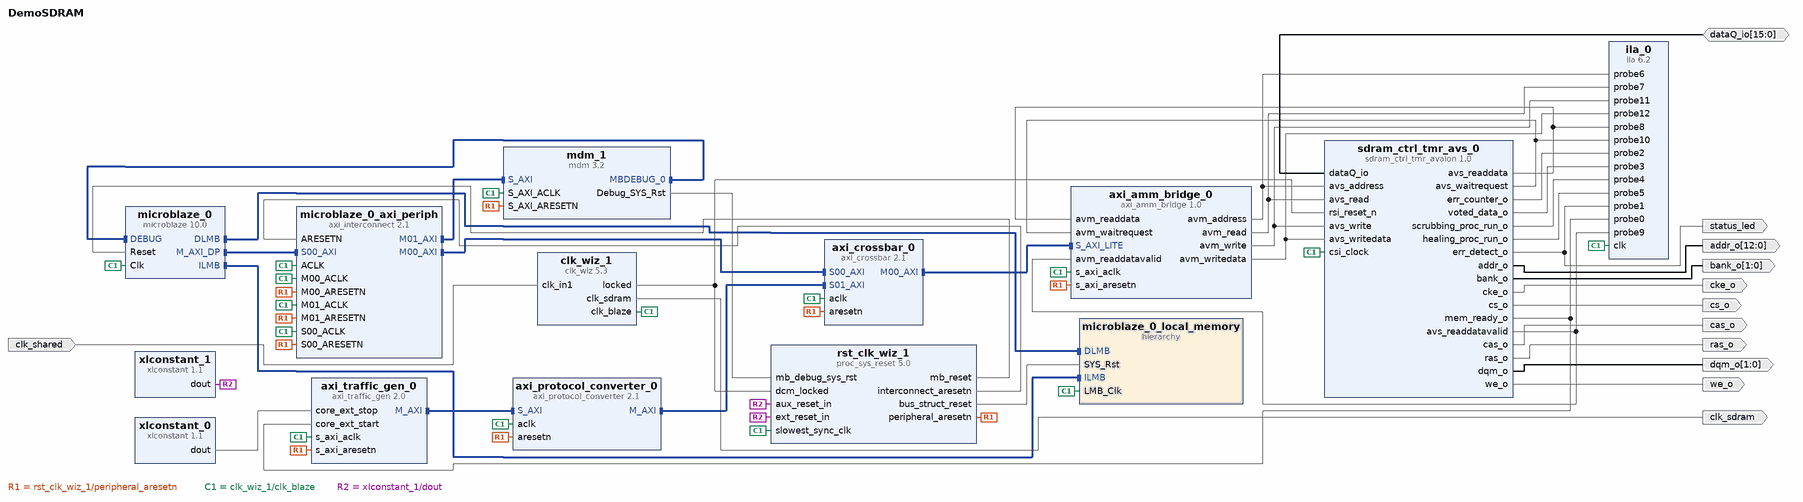
[diagram p0: block diagram of the top level]
# Vivado block design DemoSDRAM, xc7a200tfbg676-1, Vivado 2016.4
create_bd_design DemoSDRAM

create_bd_port -dir I -type clk clk_shared
set_property -dict {CONFIG.FREQ_HZ 12000000} [get_bd_ports clk_shared]
create_bd_port -dir O cke_o
create_bd_port -dir O -from 1 -to 0 bank_o
create_bd_port -dir O -from 12 -to 0 addr_o
create_bd_port -dir O cs_o
create_bd_port -dir O ras_o
create_bd_port -dir O cas_o
create_bd_port -dir O we_o
create_bd_port -dir O -from 1 -to 0 dqm_o
create_bd_port -dir IO -from 15 -to 0 dataQ_io
create_bd_port -dir O status_led
create_bd_port -dir O -type clk clk_sdram

create_bd_cell -type hier microblaze_0_local_memory
create_bd_cell -type ip -vlnv xilinx.com:ip:axi_amm_bridge:1.0 axi_amm_bridge_0
set_property -dict [list \
  CONFIG.C_HAS_READ_DATA_VALID 1 \
  CONFIG.C_READ_LATENCY 2 \
  CONFIG.C_BURST_SUPPORT 0 \
  CONFIG.C_S_AXI_ADDR_WIDTH 24 \
  CONFIG.C_NUM_ADDRESS_RANGES 0 \
  CONFIG.C_HIGH1_ADDR 0x000000000FFFFFFF \
  CONFIG.C_ADDRESS_MODE 0 \
  CONFIG.C_USE_BYTEENABLE 0 \
  CONFIG.C_HAS_RESPONSE 0 \
] [get_bd_cells axi_amm_bridge_0]
create_bd_cell -type ip -vlnv xilinx.com:ip:clk_wiz:5.3 clk_wiz_1
set_property -dict [list \
  CONFIG.PRIMITIVE MMCM \
  CONFIG.USE_MIN_POWER false \
  CONFIG.JITTER_SEL No_Jitter \
  CONFIG.PRIM_IN_FREQ 12 \
  CONFIG.CLKIN1_JITTER_PS 833.33 \
  CONFIG.CLKOUT2_USED true \
  CONFIG.CLKOUT3_USED false \
  CONFIG.NUM_OUT_CLKS 2 \
  CONFIG.CLK_OUT1_PORT clk_blaze \
  CONFIG.CLK_OUT2_PORT clk_sdram \
  CONFIG.CLK_OUT3_PORT clk_sdram \
  CONFIG.CLKOUT1_REQUESTED_OUT_FREQ 48 \
  CONFIG.CLKOUT2_REQUESTED_OUT_FREQ 48 \
  CONFIG.CLKOUT2_REQUESTED_PHASE -18 \
  CONFIG.CLKOUT3_REQUESTED_OUT_FREQ 12 \
  CONFIG.CLKOUT3_REQUESTED_PHASE 0 \
  CONFIG.PRIM_SOURCE Single_ended_clock_capable_pin \
  CONFIG.CLKOUT1_DRIVES BUFGCE \
  CONFIG.CLKOUT2_DRIVES BUFGCE \
  CONFIG.CLKOUT3_DRIVES BUFGCE \
  CONFIG.CLKOUT4_DRIVES BUFGCE \
  CONFIG.CLKOUT5_DRIVES BUFGCE \
  CONFIG.CLKOUT6_DRIVES BUFGCE \
  CONFIG.CLKOUT7_DRIVES BUFGCE \
  CONFIG.FEEDBACK_SOURCE FDBK_AUTO \
  CONFIG.USE_RESET false \
  CONFIG.MMCM_DIVCLK_DIVIDE 1 \
  CONFIG.MMCM_BANDWIDTH OPTIMIZED \
  CONFIG.MMCM_CLKFBOUT_MULT_F 60.000 \
  CONFIG.MMCM_CLKIN1_PERIOD 83.333 \
  CONFIG.MMCM_COMPENSATION ZHOLD \
  CONFIG.MMCM_CLKOUT0_DIVIDE_F 15.000 \
  CONFIG.MMCM_CLKOUT0_DUTY_CYCLE 0.500 \
  CONFIG.MMCM_CLKOUT1_DIVIDE 15 \
  CONFIG.MMCM_CLKOUT1_DUTY_CYCLE 0.500 \
  CONFIG.MMCM_CLKOUT1_PHASE -18.000 \
  CONFIG.MMCM_CLKOUT2_DIVIDE 1 \
  CONFIG.MMCM_CLKOUT2_DUTY_CYCLE 0.500 \
  CONFIG.MMCM_CLKOUT2_PHASE 0.000 \
  CONFIG.USE_SAFE_CLOCK_STARTUP true \
  CONFIG.CLKOUT1_JITTER 547.406 \
  CONFIG.CLKOUT1_PHASE_ERROR 663.293 \
  CONFIG.CLKOUT2_JITTER 547.406 \
  CONFIG.CLKOUT2_PHASE_ERROR 663.293 \
  CONFIG.CLKOUT3_JITTER 673.233 \
  CONFIG.CLKOUT3_PHASE_ERROR 693.818 \
] [get_bd_cells clk_wiz_1]
create_bd_cell -type ip -vlnv xilinx.com:ip:mdm:3.2 mdm_1
set_property -dict {CONFIG.C_USE_UART 1} [get_bd_cells mdm_1]
create_bd_cell -type ip -vlnv xilinx.com:ip:microblaze:10.0 microblaze_0
set_property -dict [list \
  CONFIG.C_D_AXI 1 \
  CONFIG.C_D_LMB 1 \
  CONFIG.C_I_LMB 1 \
  CONFIG.C_TRACE 1 \
  CONFIG.C_USE_BARREL 1 \
  CONFIG.C_USE_DIV 1 \
  CONFIG.C_USE_HW_MUL 1 \
  CONFIG.C_USE_FPU 1 \
  CONFIG.C_DEBUG_ENABLED 1 \
  CONFIG.C_NUMBER_OF_RD_ADDR_BRK 1 \
  CONFIG.C_NUMBER_OF_WR_ADDR_BRK 1 \
] [get_bd_cells microblaze_0]
create_bd_cell -type ip -vlnv xilinx.com:ip:proc_sys_reset:5.0 rst_clk_wiz_1
create_bd_cell -type ip -vlnv xilinx.com:ip:xlconstant:1.1 xlconstant_1
create_bd_cell -type ip -vlnv xilinx.com:ip:axi_interconnect:2.1 microblaze_0_axi_periph
set_property -dict {CONFIG.NUM_MI 2} [get_bd_cells microblaze_0_axi_periph]
create_bd_cell -type ip -vlnv xilinx.com:ip:ila:6.2 ila_0
set_property -dict [list \
  CONFIG.C_PROBE12_TYPE 1 \
  CONFIG.C_PROBE10_TYPE 0 \
  CONFIG.C_PROBE8_TYPE 1 \
  CONFIG.C_PROBE7_TYPE 0 \
  CONFIG.C_PROBE6_TYPE 1 \
  CONFIG.C_PROBE5_TYPE 0 \
  CONFIG.C_PROBE4_TYPE 0 \
  CONFIG.C_PROBE3_TYPE 1 \
  CONFIG.C_PROBE2_TYPE 1 \
  CONFIG.C_PROBE12_WIDTH 32 \
  CONFIG.C_PROBE10_WIDTH 1 \
  CONFIG.C_PROBE8_WIDTH 32 \
  CONFIG.C_PROBE7_WIDTH 1 \
  CONFIG.C_PROBE6_WIDTH 24 \
  CONFIG.C_PROBE5_WIDTH 1 \
  CONFIG.C_PROBE4_WIDTH 1 \
  CONFIG.C_PROBE3_WIDTH 16 \
  CONFIG.C_PROBE2_WIDTH 16 \
  CONFIG.C_DATA_DEPTH 8192 \
  CONFIG.C_NUM_OF_PROBES 13 \
  CONFIG.C_EN_STRG_QUAL 1 \
  CONFIG.C_PROBE5_MU_CNT 2 \
  CONFIG.C_PROBE4_MU_CNT 2 \
  CONFIG.C_PROBE3_MU_CNT 2 \
  CONFIG.C_PROBE2_MU_CNT 2 \
  CONFIG.C_PROBE1_MU_CNT 2 \
  CONFIG.C_PROBE0_MU_CNT 2 \
  CONFIG.ALL_PROBE_SAME_MU_CNT 2 \
  CONFIG.C_ENABLE_ILA_AXI_MON false \
  CONFIG.C_MONITOR_TYPE Native \
] [get_bd_cells ila_0]
create_bd_cell -type ip -vlnv xilinx.com:ip:axi_traffic_gen:2.0 axi_traffic_gen_0
set_property -dict [list \
  CONFIG.C_ATG_STATIC_HLTP_INCR false \
  CONFIG.TRAFFIC_PROFILE Data \
  CONFIG.DATA_SIZE_AVG 1 \
  CONFIG.DATA_TRAFFIC_PATTERN Fixed \
  CONFIG.DATA_ITG_GAP 256 \
  CONFIG.DATA_TRANS_TYPE Write_Only \
  CONFIG.C_ATG_REPEAT_TYPE Repetitive \
  CONFIG.MASTER_HIGH_ADDRESS 0x007FFFFF \
  CONFIG.ATG_OPTIONS {High Level Traffic} \
] [get_bd_cells axi_traffic_gen_0]
create_bd_cell -type ip -vlnv xilinx.com:ip:axi_protocol_converter:2.1 axi_protocol_converter_0
set_property -dict {CONFIG.ADDR_WIDTH 24} [get_bd_cells axi_protocol_converter_0]
create_bd_cell -type ip -vlnv xilinx.com:ip:axi_crossbar:2.1 axi_crossbar_0
set_property -dict [list \
  CONFIG.NUM_SI 2 \
  CONFIG.NUM_MI 1 \
  CONFIG.S00_ARB_PRIORITY 1 \
  CONFIG.S01_ARB_PRIORITY 2 \
] [get_bd_cells axi_crossbar_0]
create_bd_cell -type ip -vlnv xilinx.com:ip:xlconstant:1.1 xlconstant_0
set_property -dict {CONFIG.CONST_VAL 0} [get_bd_cells xlconstant_0]
create_bd_cell -type ip -vlnv ekyr.kth.se:user:sdram_ctrl_tmr_avalon:1.0 sdram_ctrl_tmr_avs_0
set_property -dict [list \
  CONFIG.NOP_BOOT_CYCLES 20000 \
  CONFIG.REF_PERIOD 32 \
  CONFIG.CAS_LAT_CYCLES 2 \
  CONFIG.TMR_COLS 384 \
  CONFIG.SCRUBBER_WAIT_CYCLES 64 \
  CONFIG.GEN_ERR_INJ false \
] [get_bd_cells sdram_ctrl_tmr_avs_0]

# ---- hierarchy /microblaze_0_local_memory ----
current_bd_instance /microblaze_0_local_memory
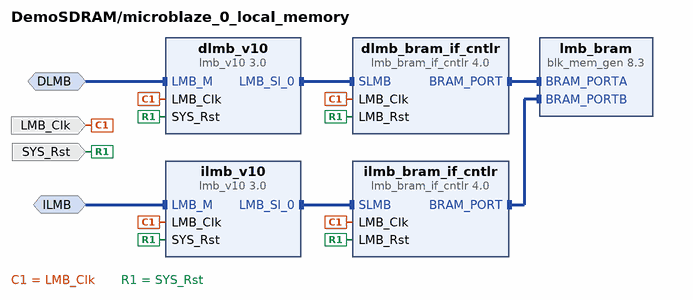
[diagram p1: block diagram inside /microblaze_0_local_memory]
create_bd_intf_pin -mode MirroredMaster -vlnv xilinx.com:interface:lmb_rtl:1.0 DLMB
create_bd_intf_pin -mode MirroredMaster -vlnv xilinx.com:interface:lmb_rtl:1.0 ILMB
create_bd_pin -dir I -type clk LMB_Clk
create_bd_pin -dir I -type rst SYS_Rst

create_bd_cell -type ip -vlnv xilinx.com:ip:lmb_bram_if_cntlr:4.0 dlmb_bram_if_cntlr
set_property -dict {CONFIG.C_ECC 0} [get_bd_cells dlmb_bram_if_cntlr]
create_bd_cell -type ip -vlnv xilinx.com:ip:lmb_v10:3.0 dlmb_v10
create_bd_cell -type ip -vlnv xilinx.com:ip:lmb_bram_if_cntlr:4.0 ilmb_bram_if_cntlr
set_property -dict {CONFIG.C_ECC 0} [get_bd_cells ilmb_bram_if_cntlr]
create_bd_cell -type ip -vlnv xilinx.com:ip:lmb_v10:3.0 ilmb_v10
create_bd_cell -type ip -vlnv xilinx.com:ip:blk_mem_gen:8.3 lmb_bram
set_property -dict {CONFIG.Memory_Type True_Dual_Port_RAM CONFIG.use_bram_block BRAM_Controller} [get_bd_cells lmb_bram]

# ---- connections ----

current_bd_instance /microblaze_0_local_memory
connect_bd_intf_net -intf_net microblaze_0_dlmb_bus [get_bd_intf_pins dlmb_v10/LMB_Sl_0] [get_bd_intf_pins dlmb_bram_if_cntlr/SLMB]
connect_bd_intf_net -intf_net microblaze_0_ilmb_bus [get_bd_intf_pins ilmb_v10/LMB_Sl_0] [get_bd_intf_pins ilmb_bram_if_cntlr/SLMB]
connect_bd_intf_net -intf_net microblaze_0_dlmb_cntlr [get_bd_intf_pins dlmb_bram_if_cntlr/BRAM_PORT] [get_bd_intf_pins lmb_bram/BRAM_PORTA]
connect_bd_intf_net -intf_net microblaze_0_ilmb_cntlr [get_bd_intf_pins ilmb_bram_if_cntlr/BRAM_PORT] [get_bd_intf_pins lmb_bram/BRAM_PORTB]
connect_bd_intf_net -intf_net microblaze_0_dlmb [get_bd_intf_pins DLMB] [get_bd_intf_pins dlmb_v10/LMB_M]
connect_bd_intf_net -intf_net microblaze_0_ilmb [get_bd_intf_pins ILMB] [get_bd_intf_pins ilmb_v10/LMB_M]
connect_bd_net -net microblaze_0_Clk [get_bd_pins LMB_Clk] \
  [get_bd_pins dlmb_bram_if_cntlr/LMB_Clk] [get_bd_pins dlmb_v10/LMB_Clk] [get_bd_pins ilmb_bram_if_cntlr/LMB_Clk] \
  [get_bd_pins ilmb_v10/LMB_Clk]
connect_bd_net [get_bd_pins SYS_Rst] \
  [get_bd_pins dlmb_bram_if_cntlr/LMB_Rst] [get_bd_pins dlmb_v10/SYS_Rst] [get_bd_pins ilmb_bram_if_cntlr/LMB_Rst] \
  [get_bd_pins ilmb_v10/SYS_Rst]

current_bd_instance /
connect_bd_intf_net [get_bd_intf_pins microblaze_0/DLMB] [get_bd_intf_pins microblaze_0_local_memory/DLMB]
connect_bd_intf_net [get_bd_intf_pins microblaze_0/ILMB] [get_bd_intf_pins microblaze_0_local_memory/ILMB]
connect_bd_intf_net [get_bd_intf_pins mdm_1/MBDEBUG_0] [get_bd_intf_pins microblaze_0/DEBUG]
connect_bd_intf_net [get_bd_intf_pins microblaze_0/M_AXI_DP] [get_bd_intf_pins microblaze_0_axi_periph/S00_AXI]
connect_bd_intf_net [get_bd_intf_pins microblaze_0_axi_periph/M01_AXI] [get_bd_intf_pins mdm_1/S_AXI]
connect_bd_intf_net [get_bd_intf_pins axi_traffic_gen_0/M_AXI] [get_bd_intf_pins axi_protocol_converter_0/S_AXI]
connect_bd_intf_net [get_bd_intf_pins microblaze_0_axi_periph/M00_AXI] [get_bd_intf_pins axi_crossbar_0/S00_AXI]
connect_bd_intf_net [get_bd_intf_pins axi_protocol_converter_0/M_AXI] [get_bd_intf_pins axi_crossbar_0/S01_AXI]
connect_bd_intf_net [get_bd_intf_pins axi_crossbar_0/M00_AXI] [get_bd_intf_pins axi_amm_bridge_0/S_AXI_LITE]
connect_bd_net -net rst_clk_wiz_1_100M_mb_reset [get_bd_pins rst_clk_wiz_1/mb_reset] [get_bd_pins microblaze_0/Reset]
connect_bd_net [get_bd_pins mdm_1/Debug_SYS_Rst] [get_bd_pins rst_clk_wiz_1/mb_debug_sys_rst]
connect_bd_net -net clk_in1_1 [get_bd_ports clk_shared] [get_bd_pins clk_wiz_1/clk_in1]
connect_bd_net -net sdram_ctrl_tmr_avalon_0_cke_o [get_bd_pins sdram_ctrl_tmr_avs_0/cke_o] [get_bd_ports cke_o]
connect_bd_net -net sdram_ctrl_tmr_avalon_0_bank_o [get_bd_pins sdram_ctrl_tmr_avs_0/bank_o] [get_bd_ports bank_o]
connect_bd_net -net sdram_ctrl_tmr_avalon_0_addr_o [get_bd_pins sdram_ctrl_tmr_avs_0/addr_o] [get_bd_ports addr_o]
connect_bd_net -net sdram_ctrl_tmr_avalon_0_cs_o [get_bd_pins sdram_ctrl_tmr_avs_0/cs_o] [get_bd_ports cs_o]
connect_bd_net -net sdram_ctrl_tmr_avalon_0_ras_o [get_bd_pins sdram_ctrl_tmr_avs_0/ras_o] [get_bd_ports ras_o]
connect_bd_net -net sdram_ctrl_tmr_avalon_0_cas_o [get_bd_pins sdram_ctrl_tmr_avs_0/cas_o] [get_bd_ports cas_o]
connect_bd_net -net sdram_ctrl_tmr_avalon_0_we_o [get_bd_pins sdram_ctrl_tmr_avs_0/we_o] [get_bd_ports we_o]
connect_bd_net -net sdram_ctrl_tmr_avalon_0_dqm_o [get_bd_pins sdram_ctrl_tmr_avs_0/dqm_o] [get_bd_ports dqm_o]
connect_bd_net [get_bd_ports dataQ_io] [get_bd_pins sdram_ctrl_tmr_avs_0/dataQ_io]
connect_bd_net [get_bd_pins rst_clk_wiz_1/peripheral_aresetn] \
  [get_bd_pins axi_amm_bridge_0/s_axi_aresetn] [get_bd_pins mdm_1/S_AXI_ARESETN] \
  [get_bd_pins axi_traffic_gen_0/s_axi_aresetn] [get_bd_pins axi_protocol_converter_0/aresetn] \
  [get_bd_pins axi_crossbar_0/aresetn] [get_bd_pins microblaze_0_axi_periph/S00_ARESETN] \
  [get_bd_pins microblaze_0_axi_periph/M00_ARESETN] [get_bd_pins microblaze_0_axi_periph/M01_ARESETN]
connect_bd_net [get_bd_pins rst_clk_wiz_1/interconnect_aresetn] [get_bd_pins microblaze_0_axi_periph/ARESETN]
connect_bd_net [get_bd_pins axi_amm_bridge_0/avm_address] [get_bd_pins ila_0/probe6] [get_bd_pins sdram_ctrl_tmr_avs_0/avs_address]
connect_bd_net [get_bd_pins axi_amm_bridge_0/avm_read] [get_bd_pins ila_0/probe7] [get_bd_pins sdram_ctrl_tmr_avs_0/avs_read]
connect_bd_net [get_bd_pins axi_amm_bridge_0/avm_write] [get_bd_pins ila_0/probe11] [get_bd_pins sdram_ctrl_tmr_avs_0/avs_write]
connect_bd_net -net sdram_ctrl_tmr_avalon_0_avs_readdata [get_bd_pins sdram_ctrl_tmr_avs_0/avs_readdata] \
  [get_bd_pins axi_amm_bridge_0/avm_readdata] [get_bd_pins ila_0/probe8]
connect_bd_net [get_bd_pins axi_amm_bridge_0/avm_writedata] [get_bd_pins ila_0/probe12] [get_bd_pins sdram_ctrl_tmr_avs_0/avs_writedata]
connect_bd_net -net sdram_ctrl_tmr_avalon_0_avs_waitrequest [get_bd_pins sdram_ctrl_tmr_avs_0/avs_waitrequest] \
  [get_bd_pins axi_amm_bridge_0/avm_waitrequest] [get_bd_pins ila_0/probe10]
connect_bd_net -net sdram_ctrl_tmr_avalon_0_err_detect_o [get_bd_pins sdram_ctrl_tmr_avs_0/err_detect_o] \
  [get_bd_ports status_led] [get_bd_pins ila_0/probe1]
connect_bd_net -net rst_clk_wiz_1_100M_bus_struct_reset [get_bd_pins rst_clk_wiz_1/bus_struct_reset] [get_bd_pins microblaze_0_local_memory/SYS_Rst]
connect_bd_net [get_bd_pins clk_wiz_1/clk_sdram] [get_bd_ports clk_sdram]
connect_bd_net [get_bd_pins clk_wiz_1/clk_blaze] \
  [get_bd_pins rst_clk_wiz_1/slowest_sync_clk] [get_bd_pins mdm_1/S_AXI_ACLK] [get_bd_pins microblaze_0/Clk] \
  [get_bd_pins axi_amm_bridge_0/s_axi_aclk] [get_bd_pins ila_0/clk] [get_bd_pins axi_traffic_gen_0/s_axi_aclk] \
  [get_bd_pins axi_protocol_converter_0/aclk] [get_bd_pins axi_crossbar_0/aclk] \
  [get_bd_pins microblaze_0_axi_periph/M00_ACLK] [get_bd_pins microblaze_0_axi_periph/M01_ACLK] \
  [get_bd_pins microblaze_0_axi_periph/S00_ACLK] [get_bd_pins microblaze_0_axi_periph/ACLK] \
  [get_bd_pins microblaze_0_local_memory/LMB_Clk] [get_bd_pins sdram_ctrl_tmr_avs_0/csi_clock]
connect_bd_net [get_bd_pins clk_wiz_1/locked] [get_bd_pins rst_clk_wiz_1/dcm_locked] [get_bd_pins sdram_ctrl_tmr_avs_0/rsi_reset_n]
connect_bd_net -net sdram_ctrl_tmr_avalon_0_mem_ready_o [get_bd_pins sdram_ctrl_tmr_avs_0/mem_ready_o] \
  [get_bd_pins ila_0/probe0] [get_bd_pins axi_traffic_gen_0/core_ext_start]
connect_bd_net -net sdram_ctrl_tmr_avalon_0_err_counter_o [get_bd_pins sdram_ctrl_tmr_avs_0/err_counter_o] [get_bd_pins ila_0/probe2]
connect_bd_net -net sdram_ctrl_tmr_avalon_0_voted_data_o [get_bd_pins sdram_ctrl_tmr_avs_0/voted_data_o] [get_bd_pins ila_0/probe3]
connect_bd_net -net sdram_ctrl_tmr_avalon_0_scrubbing_proc_run_o [get_bd_pins sdram_ctrl_tmr_avs_0/scrubbing_proc_run_o] [get_bd_pins ila_0/probe4]
connect_bd_net -net sdram_ctrl_tmr_avalon_0_healing_proc_run_o [get_bd_pins sdram_ctrl_tmr_avs_0/healing_proc_run_o] [get_bd_pins ila_0/probe5]
connect_bd_net [get_bd_pins sdram_ctrl_tmr_avs_0/avs_readdatavalid] [get_bd_pins axi_amm_bridge_0/avm_readdatavalid] [get_bd_pins ila_0/probe9]
connect_bd_net [get_bd_pins xlconstant_1/dout] [get_bd_pins rst_clk_wiz_1/ext_reset_in] [get_bd_pins rst_clk_wiz_1/aux_reset_in]
connect_bd_net [get_bd_pins xlconstant_0/dout] [get_bd_pins axi_traffic_gen_0/core_ext_stop]

# ---- address map ----
assign_bd_address -offset 0x00000000 -range 16M -target_address_space [get_bd_addr_spaces axi_traffic_gen_0/Data] [get_bd_addr_segs axi_amm_bridge_0/S_AXI_LITE/Reg]
assign_bd_address -offset 0x00000000 -range 16K -target_address_space [get_bd_addr_spaces microblaze_0/Data] [get_bd_addr_segs microblaze_0_local_memory/dlmb_bram_if_cntlr/SLMB/Mem]
assign_bd_address -offset 0x01000000 -range 16M -target_address_space [get_bd_addr_spaces microblaze_0/Data] [get_bd_addr_segs axi_amm_bridge_0/S_AXI_LITE/Reg]
assign_bd_address -offset 0x41400000 -range 4K -target_address_space [get_bd_addr_spaces microblaze_0/Data] [get_bd_addr_segs mdm_1/S_AXI/Reg]
assign_bd_address -offset 0x00000000 -range 16K -target_address_space [get_bd_addr_spaces microblaze_0/Instruction] [get_bd_addr_segs microblaze_0_local_memory/ilmb_bram_if_cntlr/SLMB/Mem]

validate_bd_design
save_bd_design
